# EAGLE design pyro18_io (EAGLE 7.6.0)
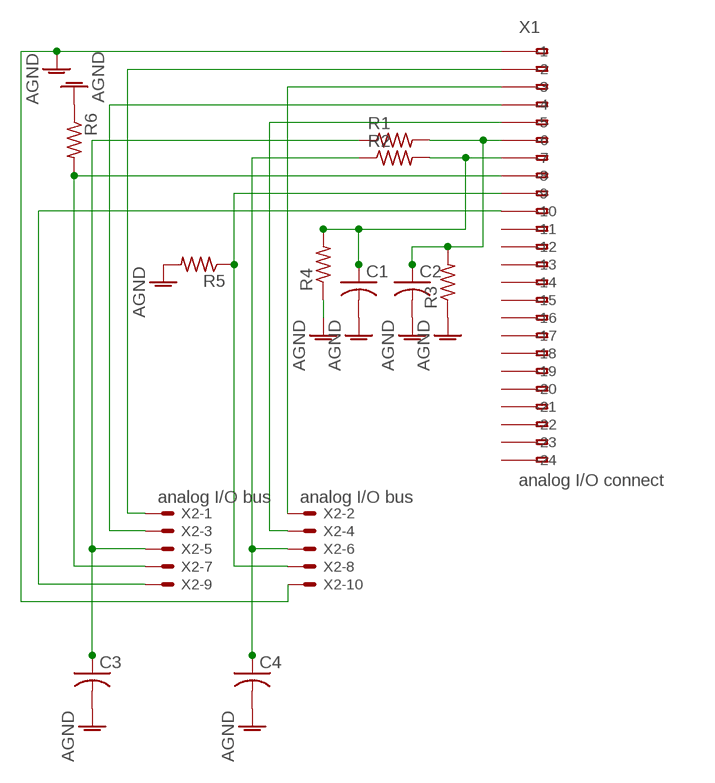
[diagram p0: schematic, sheet 1]

## Parts
C1  C-US025-024X044  [C025-024X044]
C2  C-US025-024X044  [C025-024X044]
C3  C-US025-024X044  [C025-024X044]
C4  C-US025-024X044  [C025-024X044]
R1  R-US_0204/2V  [0204V]
R2  R-US_0204/2V  [0204V]
R3  R-US_0204/2V  [0204V]
R4  R-US_0204/2V  [0204V]
R5  R-US_0204/2V  [0204V]
R6  R-US_0204/2V  [0204V]
X1  analog I/O connect  233-224  [233-224]
X2  analog I/O bus  332-10  [332-10]

## Nets
AGND: C1.2 C2.2 C3.2 C4.2 R3.1 R4.1 R5.2 R6.1 X1.A1(-1) X2.10
N$1: C1.1 R2.2 R4.2 X1.A7(-7)
N$2: X1.A10(-10) X2.9
N$3: X1.A4(-4) X2.3
N$4: X1.A2(-2) X2.1
N$5: X1.A3(-3) X2.2
N$6: X1.A5(-5) X2.4
N$7: C3.1 R1.1 X2.5
N$8: C4.1 R2.1 X2.6
N$9: R6.2 X1.A8(-8) X2.7
N$10: R5.1 X1.A9(-9) X2.8
N$11: C2.1 R1.2 R3.2 X1.A6(-6)
Unconnected: X1.A11(-11) X1.A12(-12) X1.A13(-13) X1.A14(-14) X1.A15(-15) X1.A16(-16) X1.A17(-17) X1.A18(-18) X1.A19(-19) X1.A20(-20) X1.A21(-21) X1.A22(-22) X1.A23(-23) X1.A24(-24) X1.B1(B-1) X1.B2(B-2) X1.B3(B-3) X1.B4(B-4) X1.B5(B-5) X1.B6(B-6) X1.B7(B-7) X1.B8(B-8) X1.B9(B-9) X1.B10(B-10) X1.B11(B-11) X1.B12(B-12) X1.B13(B-13) X1.B14(B-14) X1.B15(B-15) X1.B16(B-16) X1.B17(B-17) X1.B18(B-18) X1.B19(B-19) X1.B20(B-20) X1.B21(B-21) X1.B22(B-22) X1.B23(B-23) X1.B24(B-24)

## Library data of the parts
C1-C4 = resistor:C-US: CAPACITOR, American symbol
R1-R6 = resistor:R-US_: RESISTOR, American symbol
X1 = con-wago255:233-224: WAGO; MPN: 233-224; OC_FARNELL: unknown; OC_NEWARK: 28K9070
X2 = con-garry:332-10: 10 Pin - 2mm Dual Row Source: www.mpe-connector.de / garry_shortform_2012.pdf

## Board
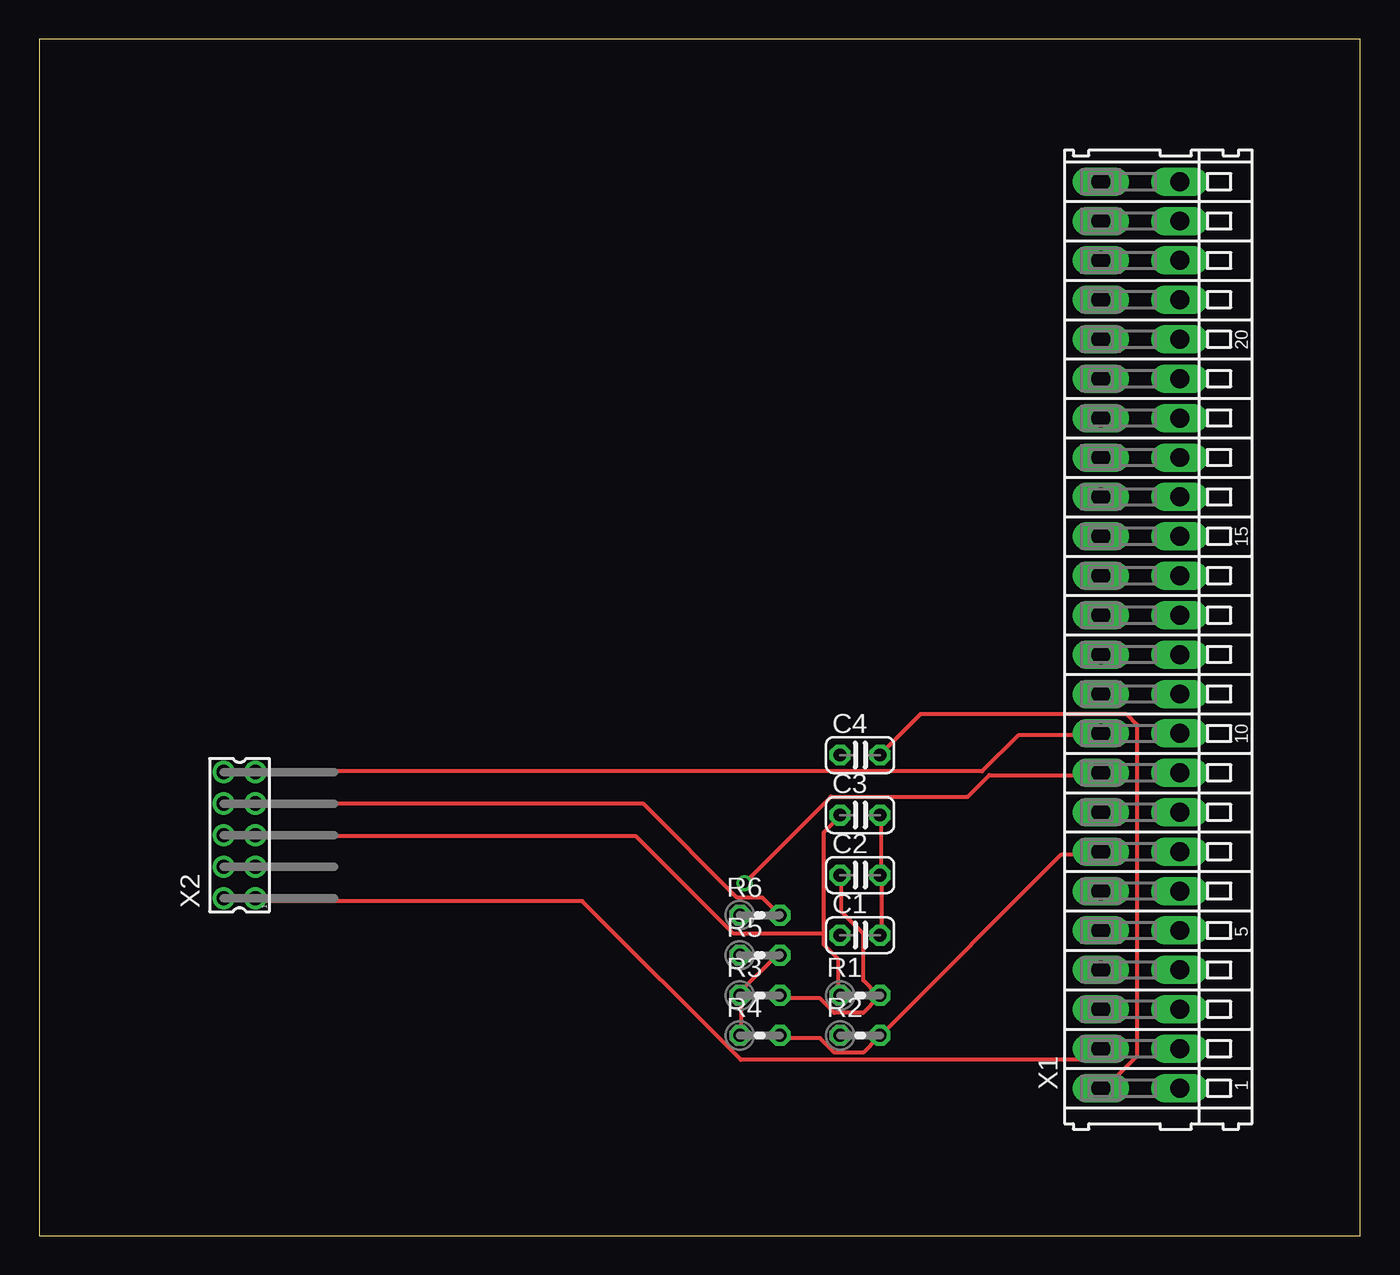
[diagram p1: board, top side]
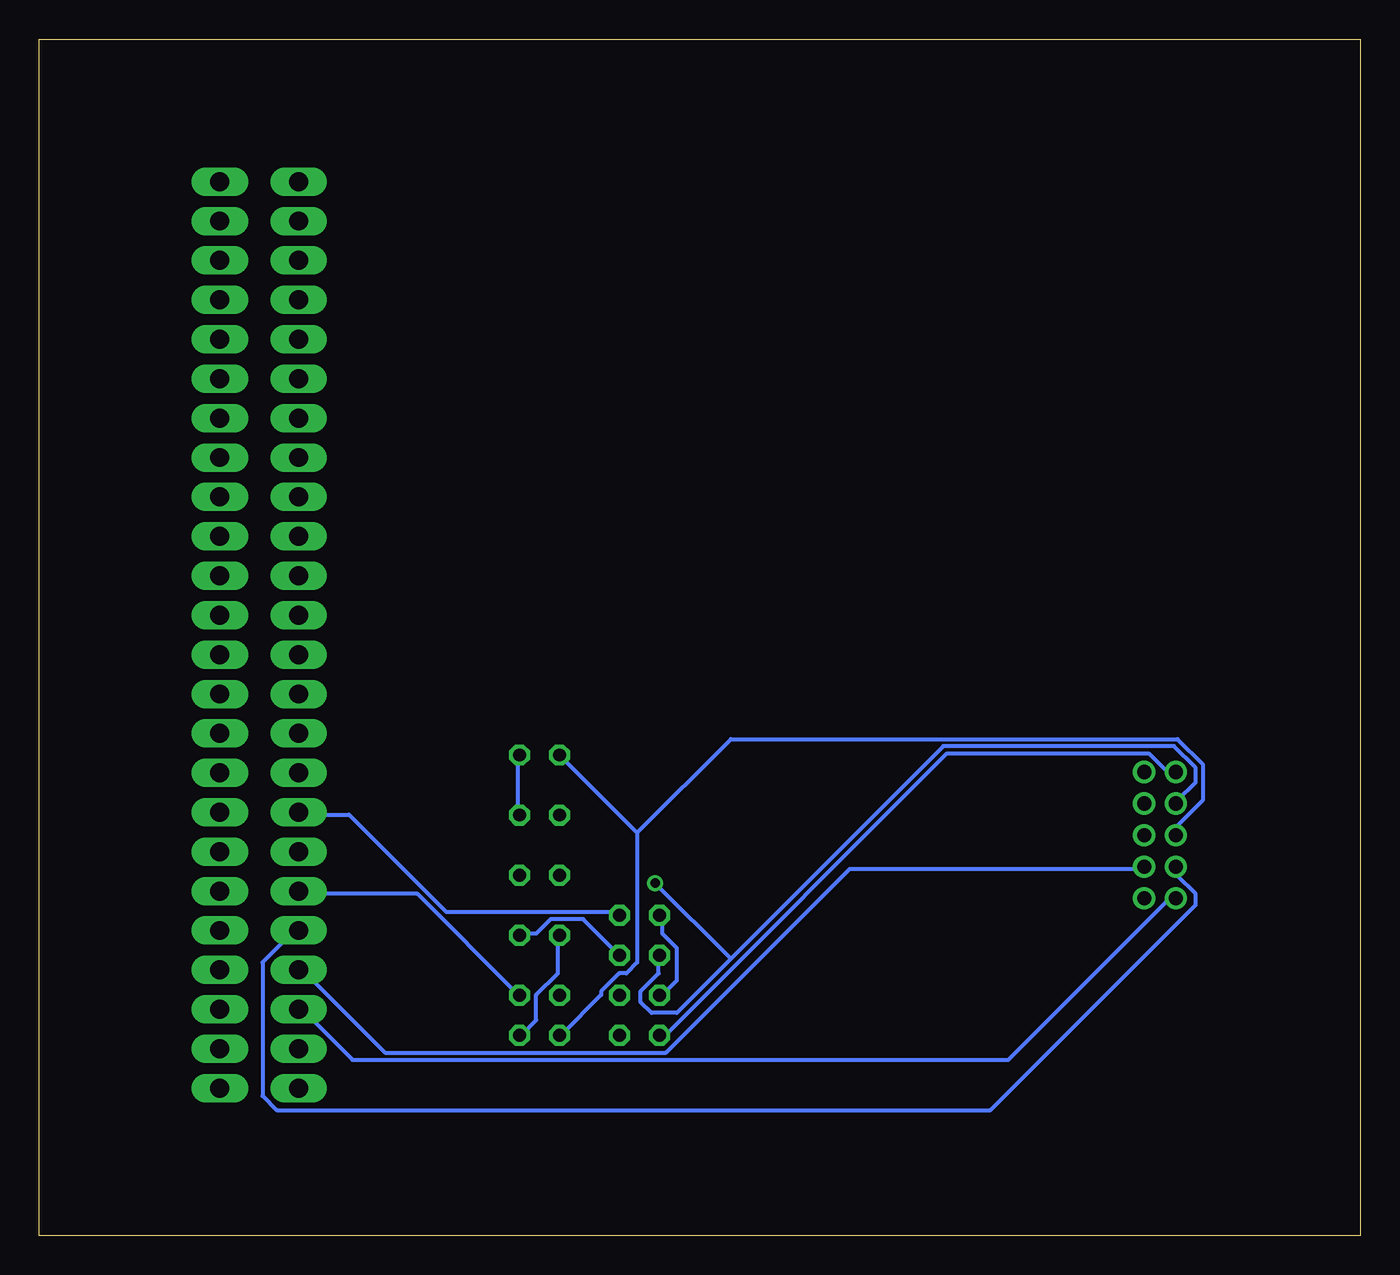
[diagram p2: board, bottom side, seen from below]

Size 83.8 x 75.87 mm. Coordinates in mm from the lower left corner, seen from the top.
Outline: 0,0 83.8,0 83.8,75.87 0,75.87 0,0
Copper layers (1*16): Top 0.035mm / dielectric 1.5mm / Bottom 0.035mm
Design rules "default": minimum track width 10mil, minimum drill 24mil, track to track 8mil, track to pad 8mil, pad to pad 8mil, via to via 8mil, smd to smd 8mil, copper to edge 40mil, drill to drill 8mil, minimum pad ring 10mil, minimum via ring 8mil, stop-mask expansion 4mil, vias tented up to drill 0mil, thermal gap 10mil

### Footprints (pad centres in the part's own frame; a part is rotated, then mirrored left to right if it is on the bottom)
C025-024X044 = drill 0.813 octagon: 1 -1.27,0; 2 1.27,0
0204V = drill 0.813 octagon: 1 -1.27,0; 2 1.27,0
233-224 = drill 1.2 long: A1 -28.75,2.5; A2 -26.25,2.5; A3 -23.75,2.5; A4 -21.25,2.5; A5 -18.75,2.5; A6 -16.25,2.5; A7 -13.75,2.5; A8 -11.25,2.5; A9 -8.75,2.5; A10 -6.25,2.5; A11 -3.75,2.5; A12 -1.25,2.5; A13 1.25,2.5; A14 3.75,2.5; A15 6.25,2.5; A16 8.75,2.5; A17 11.25,2.5; A18 13.75,2.5; A19 16.25,2.5; A20 18.75,2.5; A21 21.25,2.5; A22 23.75,2.5; A23 26.25,2.5; A24 28.75,2.5; B1 -28.75,-2.5; B2 -26.25,-2.5; B3 -23.75,-2.5; B4 -21.25,-2.5; B5 -18.75,-2.5; B6 -16.25,-2.5; B7 -13.75,-2.5; B8 -11.25,-2.5; B9 -8.75,-2.5; B10 -6.25,-2.5; B11 -3.75,-2.5; B12 -1.25,-2.5; B13 1.25,-2.5; B14 3.75,-2.5; B15 6.25,-2.5; B16 8.75,-2.5; B17 11.25,-2.5; B18 13.75,-2.5; B19 16.25,-2.5; B20 18.75,-2.5; B21 21.25,-2.5; B22 23.75,-2.5; B23 26.25,-2.5; B24 28.75,-2.5
332-10 = drill 0.9 pad 1.27: 1 -4,-1; 2 -4,1; 3 -2,-1; 4 -2,1; 5 0,-1; 6 0,1; 7 2,-1; 8 2,1; 9 4,-1; 10 4,1

### Placement (x,y rotation side)
C1  52.07,19.05 0 top
C2  52.07,22.86 0 top
C3  52.07,26.67 0 top
C4  52.07,30.48 0 top
R1  52.07,15.24 0 top
R2  52.07,12.7 0 top
R3  45.72,15.24 0 top
R4  45.72,12.7 0 top
R5  45.72,17.78 0 top
R6  45.72,20.32 0 top
X1  69.85,38.1 90 top
X2  12.7,25.4 90 top

### Tracks (layer width: path | path; a pad name or v marks a point on that pad's centre or on a via)
AGND
  Top 0.254: C1.2 53.42,19.15 53.42,22.81 C2.2 53.42,23.04 53.42,26.47 C3.2 | X1.A1 67.36,9.55 67.82,9.55 69.65,11.38 69.65,32.41 68.96,33.1 55.93,33.1 53.42,30.58 C4.2 | R4.1 44.5,12.75 44.5,15.04 R3.1 44.27,15.26 46.79,17.78 R5.2
  Bottom 0.254: C4.2 53.42,30.35 53.42,26.7 C3.2 | R6.1 44.27,20.3 44.27,19.15 43.36,18.24 43.36,16.18 44.27,15.26 R3.1 | X2.10 11.81,29.44 12.27,29.44 13.41,30.58 26.21,30.58 44.27,12.52 R4.1 | C1.2 53.19,19.15 52.27,19.15 51.36,20.07 49.3,20.07 47.02,17.78 R5.2
N$1
  Top 0.254: R4.2 47.02,12.52 49.53,12.52 50.44,11.61 52.27,11.61 53.19,12.52 R2.2 53.42,12.75 64.85,24.18 67.13,24.18 X1.A7
  Bottom 0.254: C1.1 50.9,18.92 50.9,16.64 52.27,15.26 52.27,13.67 53.19,12.75 R2.2
N$2
  Top 0.254: X2.9 13.87,29.44 59.82,29.44 62.1,31.73 67.13,31.73 X1.A10
N$3
  Bottom 0.254: X2.3 13.87,23.27 32.38,23.27 44.04,11.61 61.87,11.61 67.13,16.87 X1.A4
N$4
  Top 0.254: X2.1 13.87,21.21 34.44,21.21 44.5,11.15 66.45,11.15 67.13,11.84 X1.A2
N$5
  Bottom 0.254: X2.2 11.81,21.21 12.27,21.21 22.33,11.15 63.93,11.15 67.13,14.35 X1.A3
N$6
  Bottom 0.254: X2.4 11.58,23.27 11.58,22.81 10.44,21.67 10.44,20.98 23.47,7.95 68.73,7.95 69.65,8.87 69.65,17.32 67.82,19.15 67.36,19.15 X1.A5
N$7
  Top 0.254: 49.76,19.15 49.76,25.55 50.67,26.47 C3.1 | 49.76,19.15 49.76,18.47 50.67,17.55 50.67,15.26 R1.1 | 49.76,19.15 44.04,19.15 37.87,25.32 13.87,25.32 X2.5
N$8
  Bottom 0.254: 45.87,25.55 45.87,17.32 46.56,16.64 47.02,16.64 48.16,15.49 48.16,15.26 50.67,12.75 R2.1 | C4.1 45.87,25.55 | 45.87,25.55 39.93,31.5 11.58,31.5 9.98,29.9 9.98,27.61 11.58,26.01 11.58,25.55 X2.6
N$9
  Top 0.254: R6.2 45.87,21.44 44.27,21.44 38.33,27.38 13.87,27.38 X2.7
  Bottom 0.254: R6.2 47.02,20.52 57.99,20.52 64.16,26.7 67.13,26.7 X1.A8
N$10  (via drill 0.61)
  Top 0.254: v44.73,22.35 50.22,27.84 58.9,27.84 60.27,29.21 67.13,29.21 X1.A9
  Bottom 0.254: 39.93,17.55 26.44,31.04 11.81,31.04 10.44,29.67 10.44,28.75 11.58,27.61 X2.8 | 39.93,17.55 43.36,14.12 44.96,14.12 45.64,14.81 45.64,15.49 44.5,16.64 44.5,17.78 R5.1 | 39.93,17.55 v44.73,22.35
N$11
  Top 0.254: R3.2 47.02,15.04 49.53,15.04 50.44,14.12 52.27,14.12 53.19,15.04 R1.2 53.19,15.26 52.27,16.18 52.27,19.15 50.9,20.52 50.9,22.81 C2.1
  Bottom 0.254: X1.A6 67.13,21.67 59.82,21.67 53.42,15.26 R1.2